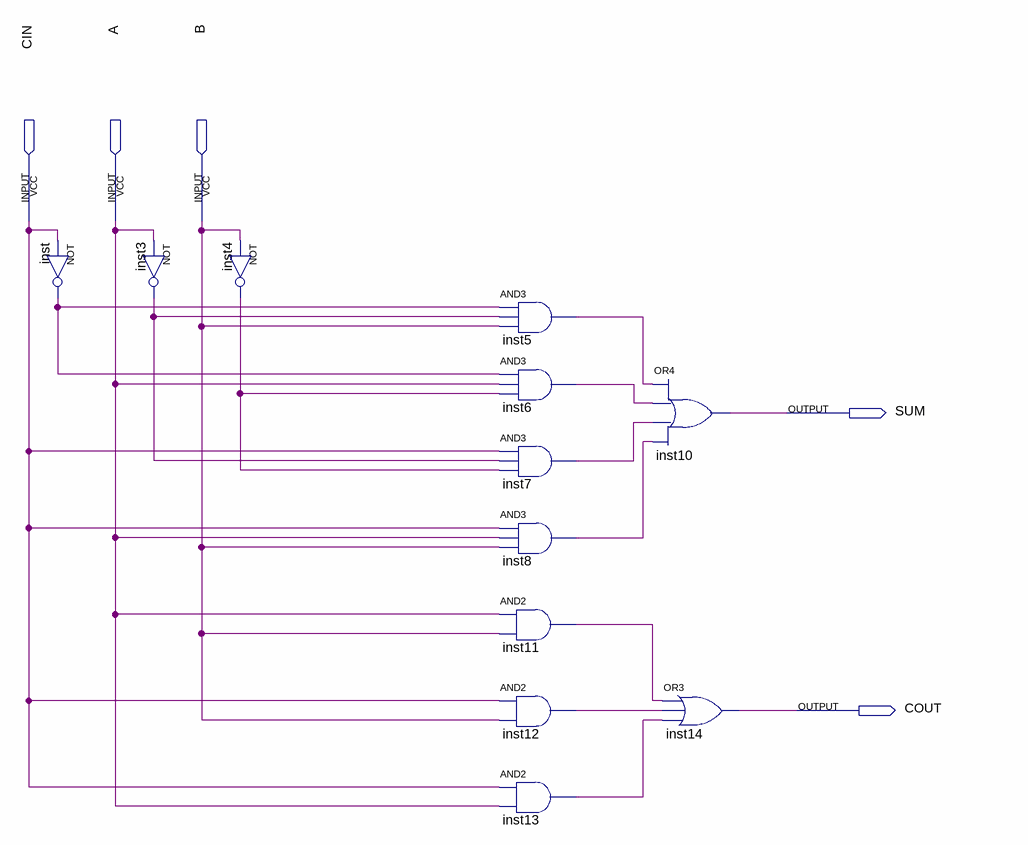
[diagram p0: schematic sheet]
// Quartus schematic FULL_ADDER_1BIT.bdf as structural Verilog: 12 symbols, 5 pins
module FULL_ADDER_1BIT (
  input  CIN,
  input  A,
  input  B,
  output SUM,
  output COUT
);

  wire inst3_out, inst4_out, inst5_out, inst6_out, inst7_out, inst8_out, inst11_out, inst12_out, inst13_out,
       inst_out;

  not inst (inst_out, CIN);
  not inst3 (inst3_out, A);
  not inst4 (inst4_out, B);
  and inst5 (inst5_out, inst_out, inst3_out, B);
  and inst6 (inst6_out, inst_out, A, inst4_out);
  and inst7 (inst7_out, CIN, inst3_out, inst4_out);
  and inst8 (inst8_out, CIN, A, B);
  and inst11 (inst11_out, A, B);
  and inst12 (inst12_out, CIN, B);
  and inst13 (inst13_out, CIN, A);
  or inst10 (SUM, inst5_out, inst6_out, inst7_out, inst8_out);
  or inst14 (COUT, inst11_out, inst12_out, inst13_out);
endmodule
